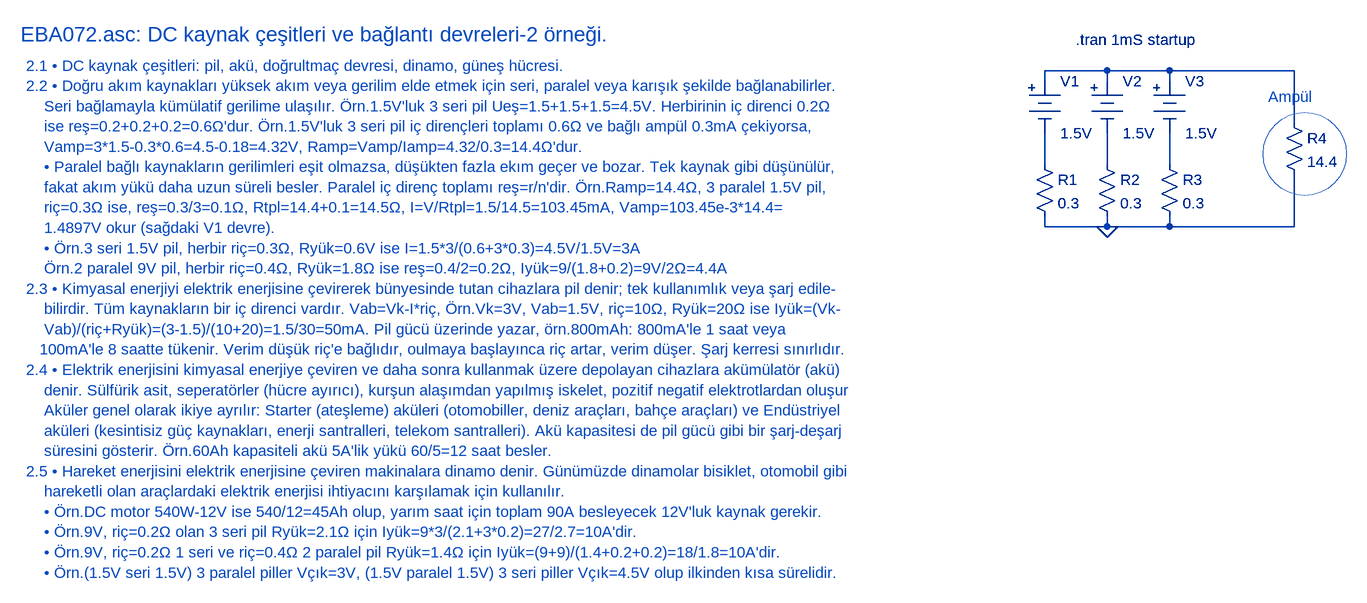
[diagram p0: schematic EBA072.asc]
EBA072.asc, the LTspice schematic file:
Version 4
SHEET 1 4076 2612
WIRE 1520 96 1424 96
WIRE 1616 96 1520 96
WIRE 1808 96 1616 96
WIRE 1424 112 1424 96
WIRE 1520 112 1520 96
WIRE 1616 112 1616 96
WIRE 1808 176 1808 96
WIRE 1424 240 1424 192
WIRE 1520 240 1520 192
WIRE 1616 240 1616 192
WIRE 1424 336 1424 320
WIRE 1520 336 1520 320
WIRE 1520 336 1424 336
WIRE 1616 336 1616 320
WIRE 1616 336 1520 336
WIRE 1808 336 1808 256
WIRE 1808 336 1616 336
FLAG 1520 336 0
SYMBOL Misc\\battery 1424 96 R0
SYMATTR InstName V1
SYMATTR Value 1.5V
SYMBOL Misc\\battery 1520 96 R0
SYMATTR InstName V2
SYMATTR Value 1.5V
SYMBOL Misc\\battery 1616 96 R0
SYMATTR InstName V3
SYMATTR Value 1.5V
SYMBOL res 1408 224 R0
SYMATTR InstName R1
SYMATTR Value 0.3
SYMBOL res 1504 224 R0
SYMATTR InstName R2
SYMATTR Value 0.3
SYMBOL res 1600 224 R0
SYMATTR InstName R3
SYMATTR Value 0.3
SYMBOL res 1792 160 R0
SYMATTR InstName R4
SYMATTR Value 14.4
TEXT -152 40 Left 3 ;EBA072.asc: DC kaynak çeşitleri ve bağlantı devreleri-2 örneği.
TEXT -144 88 Left 2 ;2.1 • DC kaynak çeşitleri: pil, akü, doğrultmaç devresi, dinamo, güneş hücresi.\n2.2 • Doğru akım kaynakları yüksek akım veya gerilim elde etmek için seri, paralel veya karışık şekilde bağlanabilirler.\n    Seri bağlamayla kümülatif gerilime ulaşılır. Örn.1.5V'luk 3 seri pil Ueş=1.5+1.5+1.5=4.5V. Herbirinin iç direnci 0.2Ω\n    ise reş=0.2+0.2+0.2=0.6Ω'dur. Örn.1.5V'luk 3 seri pil iç dirençleri toplamı 0.6Ω ve bağlı ampül 0.3mA çekiyorsa, \n    Vamp=3*1.5-0.3*0.6=4.5-0.18=4.32V, Ramp=Vamp/Iamp=4.32/0.3=14.4Ω'dur.\n    • Paralel bağlı kaynakların gerilimleri eşit olmazsa, düşükten fazla ekım geçer ve bozar. Tek kaynak gibi düşünülür,\n    fakat akım yükü daha uzun süreli besler. Paralel iç direnç toplamı reş=r/n'dir. Örn.Ramp=14.4Ω, 3 paralel 1.5V pil,\n    riç=0.3Ω ise, reş=0.3/3=0.1Ω, Rtpl=14.4+0.1=14.5Ω, I=V/Rtpl=1.5/14.5=103.45mA, Vamp=103.45e-3*14.4=\n    1.4897V okur (sağdaki V1 devre).\n    • Örn.3 seri 1.5V pil, herbir riç=0.3Ω, Ryük=0.6V ise I=1.5*3/(0.6+3*0.3)=4.5V/1.5V=3A\n    Örn.2 paralel 9V pil, herbir riç=0.4Ω, Ryük=1.8Ω ise reş=0.4/2=0.2Ω, Iyük=9/(1.8+0.2)=9V/2Ω=4.4A\n2.3 • Kimyasal enerjiyi elektrik enerjisine çevirerek bünyesinde tutan cihazlara pil denir; tek kullanımlık veya şarj edile-\n    bilirdir. Tüm kaynakların bir iç direnci vardır. Vab=Vk-I*riç, Örn.Vk=3V, Vab=1.5V, riç=10Ω, Ryük=20Ω ise Iyük=(Vk-\n    Vab)/(riç+Ryük)=(3-1.5)/(10+20)=1.5/30=50mA. Pil gücü üzerinde yazar, örn.800mAh: 800mA'le 1 saat veya \n   100mA'le 8 saatte tükenir. Verim düşük riç'e bağlıdır, oulmaya başlayınca riç artar, verim düşer. Şarj kerresi sınırlıdır.\n2.4 • Elektrik enerjisini kimyasal enerjiye çeviren ve daha sonra kullanmak üzere depolayan cihazlara akümülatör (akü)\n    denir. Sülfürik asit, seperatörler (hücre ayırıcı), kurşun alaşımdan yapılmış iskelet, pozitif negatif elektrotlardan oluşur\n    Aküler genel olarak ikiye ayrılır: Starter (ateşleme) aküleri (otomobiller, deniz araçları, bahçe araçları) ve Endüstriyel\n    aküleri (kesintisiz güç kaynakları, enerji santralleri, telekom santralleri). Akü kapasitesi de pil gücü gibi bir şarj-deşarj\n    süresini gösterir. Örn.60Ah kapasiteli akü 5A'lik yükü 60/5=12 saat besler.\n2.5 • Hareket enerjisini elektrik enerjisine çeviren makinalara dinamo denir. Günümüzde dinamolar bisiklet, otomobil gibi\n    hareketli olan araçlardaki elektrik enerjisi ihtiyacını karşılamak için kullanılır.\n    • Örn.DC motor 540W-12V ise 540/12=45Ah olup, yarım saat için toplam 90A besleyecek 12V'luk kaynak gerekir.\n    • Örn.9V, riç=0.2Ω olan 3 seri pil Ryük=2.1Ω için Iyük=9*3/(2.1+3*0.2)=27/2.7=10A'dir.\n    • Örn.9V, riç=0.2Ω 1 seri ve riç=0.4Ω 2 paralel pil Ryük=1.4Ω için Iyük=(9+9)/(1.4+0.2+0.2)=18/1.8=10A'dir.\n    • Örn.(1.5V seri 1.5V) 3 paralel piller Vçık=3V, (1.5V paralel 1.5V) 3 seri piller Vçık=4.5V olup ilkinden kısa sürelidir.
TEXT 1472 48 Left 2 !.tran 1mS startup
TEXT 1768 136 Left 2 ;Ampül
CIRCLE Normal 1888 288 1760 160 2

The netlist it stands for:
* EBA072.asc
V1 N001 N002 1.5V
V2 N001 N003 1.5V
V3 N001 N004 1.5V
R1 N002 0 0.3
R2 N003 0 0.3
R3 N004 0 0.3
R4 N001 0 14.4
* EBA072.asc: DC kaynak çeşitleri ve bağlantı devreleri-2 örneği.
* 2.1 • DC kaynak çeşitleri: pil, akü, doğrultmaç devresi, dinamo, güneş hücresi.
* 2.2 • Doğru akım kaynakları yüksek akım veya gerilim elde etmek için seri, paralel veya karışık şekilde bağlanabilirler.
*     Seri bağlamayla kümülatif gerilime ulaşılır. Örn.1.5V'luk 3 seri pil Ueş=1.5+1.5+1.5=4.5V. Herbirinin iç direnci 0.2Ω
*     ise reş=0.2+0.2+0.2=0.6Ω'dur. Örn.1.5V'luk 3 seri pil iç dirençleri toplamı 0.6Ω ve bağlı ampül 0.3mA çekiyorsa,
*     Vamp=3*1.5-0.3*0.6=4.5-0.18=4.32V, Ramp=Vamp/Iamp=4.32/0.3=14.4Ω'dur.
*     • Paralel bağlı kaynakların gerilimleri eşit olmazsa, düşükten fazla ekım geçer ve bozar. Tek kaynak gibi düşünülür,
*     fakat akım yükü daha uzun süreli besler. Paralel iç direnç toplamı reş=r/n'dir. Örn.Ramp=14.4Ω, 3 paralel 1.5V pil,
*     riç=0.3Ω ise, reş=0.3/3=0.1Ω, Rtpl=14.4+0.1=14.5Ω, I=V/Rtpl=1.5/14.5=103.45mA, Vamp=103.45e-3*14.4=
*     1.4897V okur (sağdaki V1 devre).
*     • Örn.3 seri 1.5V pil, herbir riç=0.3Ω, Ryük=0.6V ise I=1.5*3/(0.6+3*0.3)=4.5V/1.5V=3A
*     Örn.2 paralel 9V pil, herbir riç=0.4Ω, Ryük=1.8Ω ise reş=0.4/2=0.2Ω, Iyük=9/(1.8+0.2)=9V/2Ω=4.4A
* 2.3 • Kimyasal enerjiyi elektrik enerjisine çevirerek bünyesinde tutan cihazlara pil denir; tek kullanımlık veya şarj edile-
*     bilirdir. Tüm kaynakların bir iç direnci vardır. Vab=Vk-I*riç, Örn.Vk=3V, Vab=1.5V, riç=10Ω, Ryük=20Ω ise Iyük=(Vk-
*     Vab)/(riç+Ryük)=(3-1.5)/(10+20)=1.5/30=50mA. Pil gücü üzerinde yazar, örn.800mAh: 800mA'le 1 saat veya
*    100mA'le 8 saatte tükenir. Verim düşük riç'e bağlıdır, oulmaya başlayınca riç artar, verim düşer. Şarj kerresi sınırlıdır.
* 2.4 • Elektrik enerjisini kimyasal enerjiye çeviren ve daha sonra kullanmak üzere depolayan cihazlara akümülatör (akü)
*     denir. Sülfürik asit, seperatörler (hücre ayırıcı), kurşun alaşımdan yapılmış iskelet, pozitif negatif elektrotlardan oluşur
*     Aküler genel olarak ikiye ayrılır: Starter (ateşleme) aküleri (otomobiller, deniz araçları, bahçe araçları) ve Endüstriyel
*     aküleri (kesintisiz güç kaynakları, enerji santralleri, telekom santralleri). Akü kapasitesi de pil gücü gibi bir şarj-deşarj
*     süresini gösterir. Örn.60Ah kapasiteli akü 5A'lik yükü 60/5=12 saat besler.
* 2.5 • Hareket enerjisini elektrik enerjisine çeviren makinalara dinamo denir. Günümüzde dinamolar bisiklet, otomobil gibi
*     hareketli olan araçlardaki elektrik enerjisi ihtiyacını karşılamak için kullanılır.
*     • Örn.DC motor 540W-12V ise 540/12=45Ah olup, yarım saat için toplam 90A besleyecek 12V'luk kaynak gerekir.
*     • Örn.9V, riç=0.2Ω olan 3 seri pil Ryük=2.1Ω için Iyük=9*3/(2.1+3*0.2)=27/2.7=10A'dir.
*     • Örn.9V, riç=0.2Ω 1 seri ve riç=0.4Ω 2 paralel pil Ryük=1.4Ω için Iyük=(9+9)/(1.4+0.2+0.2)=18/1.8=10A'dir.
*     • Örn.(1.5V seri 1.5V) 3 paralel piller Vçık=3V, (1.5V paralel 1.5V) 3 seri piller Vçık=4.5V olup ilkinden kısa sürelidir.
.tran 1mS startup
* Ampül
.backanno
.end